# EAGLE design RasPi-24-Sensor-Breakout (EAGLE 7.5.0)
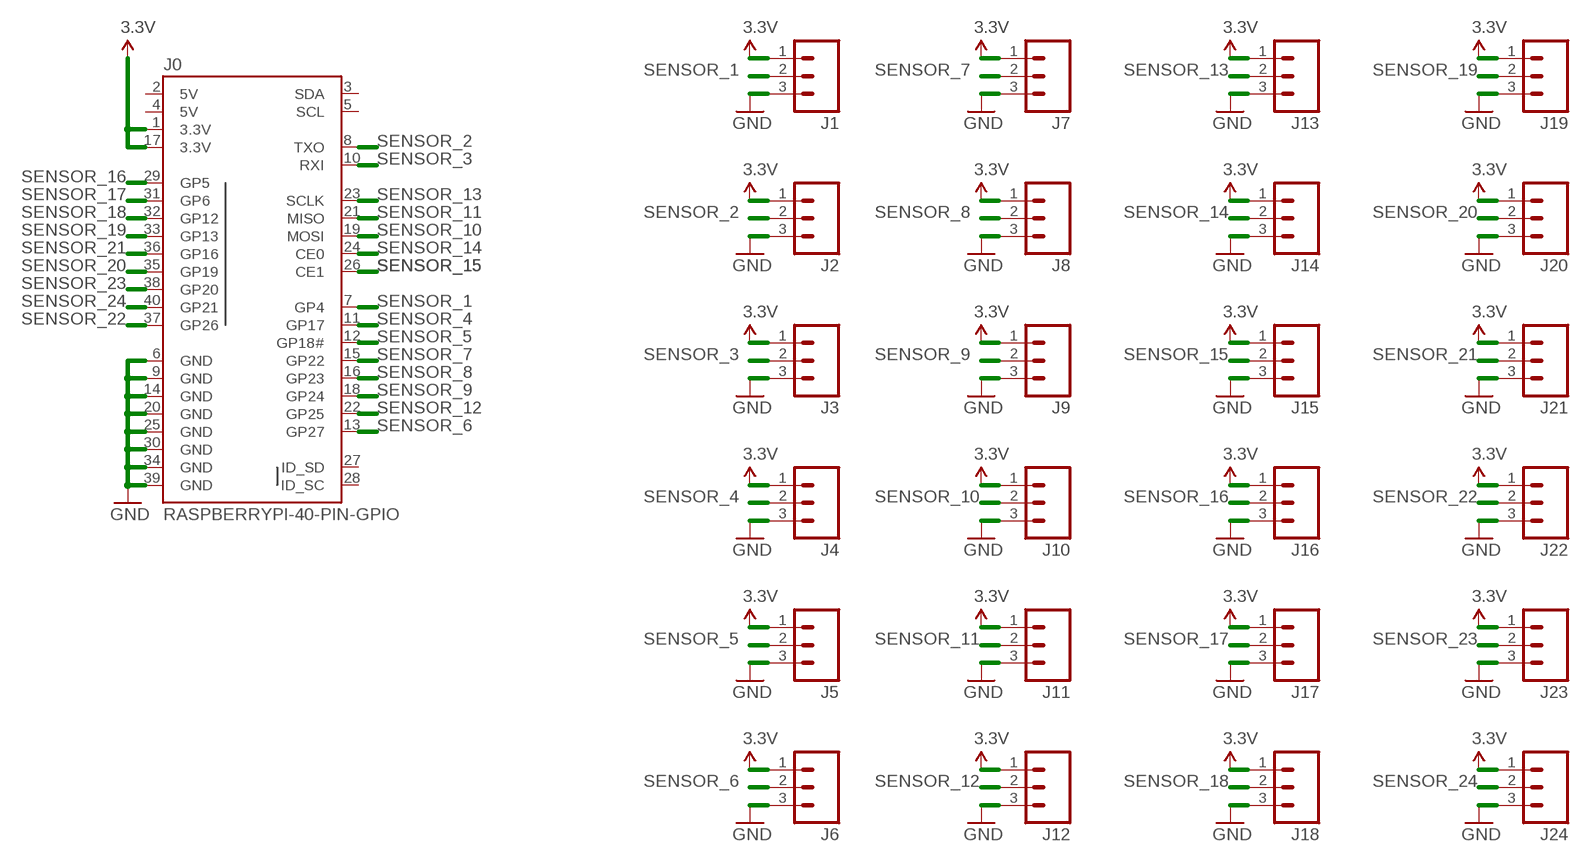
[diagram p0: schematic, sheet 1]

## Parts
J0  RASPBERRYPI-40-PIN-GPIO  [2X20-SHROUDED]
J1  M03POLAR  [MOLEX-1X3]
J2  M03POLAR  [MOLEX-1X3]
J3  M03POLAR  [MOLEX-1X3]
J4  M03POLAR  [MOLEX-1X3]
J5  M03POLAR  [MOLEX-1X3]
J6  M03POLAR  [MOLEX-1X3]
J7  M03POLAR  [MOLEX-1X3]
J8  M03POLAR  [MOLEX-1X3]
J9  M03POLAR  [MOLEX-1X3]
J10  M03POLAR  [MOLEX-1X3]
J11  M03POLAR  [MOLEX-1X3]
J12  M03POLAR  [MOLEX-1X3]
J13  M03POLAR  [MOLEX-1X3]
J14  M03POLAR  [MOLEX-1X3]
J15  M03POLAR  [MOLEX-1X3]
J16  M03POLAR  [MOLEX-1X3]
J17  M03POLAR  [MOLEX-1X3]
J18  M03POLAR  [MOLEX-1X3]
J19  M03POLAR  [MOLEX-1X3]
J20  M03POLAR  [MOLEX-1X3]
J21  M03POLAR  [MOLEX-1X3]
J22  M03POLAR  [MOLEX-1X3]
J23  M03POLAR  [MOLEX-1X3]
J24  M03POLAR  [MOLEX-1X3]

## Nets
3.3V: J0.1(3.3V) J0.17(3.3V) J1.1 J2.1 J3.1 J4.1 J5.1 J6.1 J7.1 J8.1 J9.1 J10.1 J11.1 J12.1 J13.1 J14.1 J15.1 J16.1 J17.1 J18.1 J19.1 J20.1 J21.1 J22.1 J23.1 J24.1
GND: J0.6(GND) J0.9(GND) J0.14(GND) J0.20(GND) J0.25(GND) J0.30(GND) J0.34(GND) J0.39(GND) J1.3 J2.3 J3.3 J4.3 J5.3 J6.3 J7.3 J8.3 J9.3 J10.3 J11.3 J12.3 J13.3 J14.3 J15.3 J16.3 J17.3 J18.3 J19.3 J20.3 J21.3 J22.3 J23.3 J24.3
SENSOR_1: J0.7(GP4) J1.2
SENSOR_2: J0.8(TXO) J2.2
SENSOR_3: J0.10(RXI) J3.2
SENSOR_4: J0.11(GP17) J4.2
SENSOR_5: J0.12(GP18#) J5.2
SENSOR_6: J0.13(GP27) J6.2
SENSOR_7: J0.15(GP22) J7.2
SENSOR_8: J0.16(GP23) J8.2
SENSOR_9: J0.18(GP24) J9.2
SENSOR_10: J0.19(MOSI) J10.2
SENSOR_11: J0.21(MISO) J11.2
SENSOR_12: J0.22(GP25) J12.2
SENSOR_13: J0.23(SCLK) J13.2
SENSOR_14: J0.24(CE0) J14.2
SENSOR_15: J0.26(CE1) J15.2
SENSOR_16: J0.29(GP5) J16.2
SENSOR_17: J0.31(GP6) J17.2
SENSOR_18: J0.32(GP12) J18.2
SENSOR_19: J0.33(GP13) J19.2
SENSOR_20: J0.35(GP19) J20.2
SENSOR_21: J0.36(GP16) J21.2
SENSOR_22: J0.37(GP26) J22.2
SENSOR_23: J0.38(GP20) J23.2
SENSOR_24: J0.40(GP21) J24.2
Unconnected: J0.3(SDA) J0.5(SCL) J0.27(ID_SD) J0.28(ID_SC)

## Power pins joined to a net without a drawn wire
5V: J0.2(5V) J0.4(5V)

## Library data of the parts
J0 = SparkFun-Boards:RASPBERRYPI-40-PIN-GPIO: Second Generation Raspberry Pi GPIO Header 2x20 pin connector, as found on B, B+, A+ models.
J1-J24 = SparkFun-Connectors:M03: Header 3 Standard 3-pin 0.1" header. Use with straight break away headers (SKU : PRT-00116), right angle break away headers (PRT-00553), swiss pins (PRT-00743), machine pins (PRT-00117), and female headers (PRT-00115). Molex polarized connector foot print use with SKU : PRT-08232 with associated crimp pins and housings.

## Board
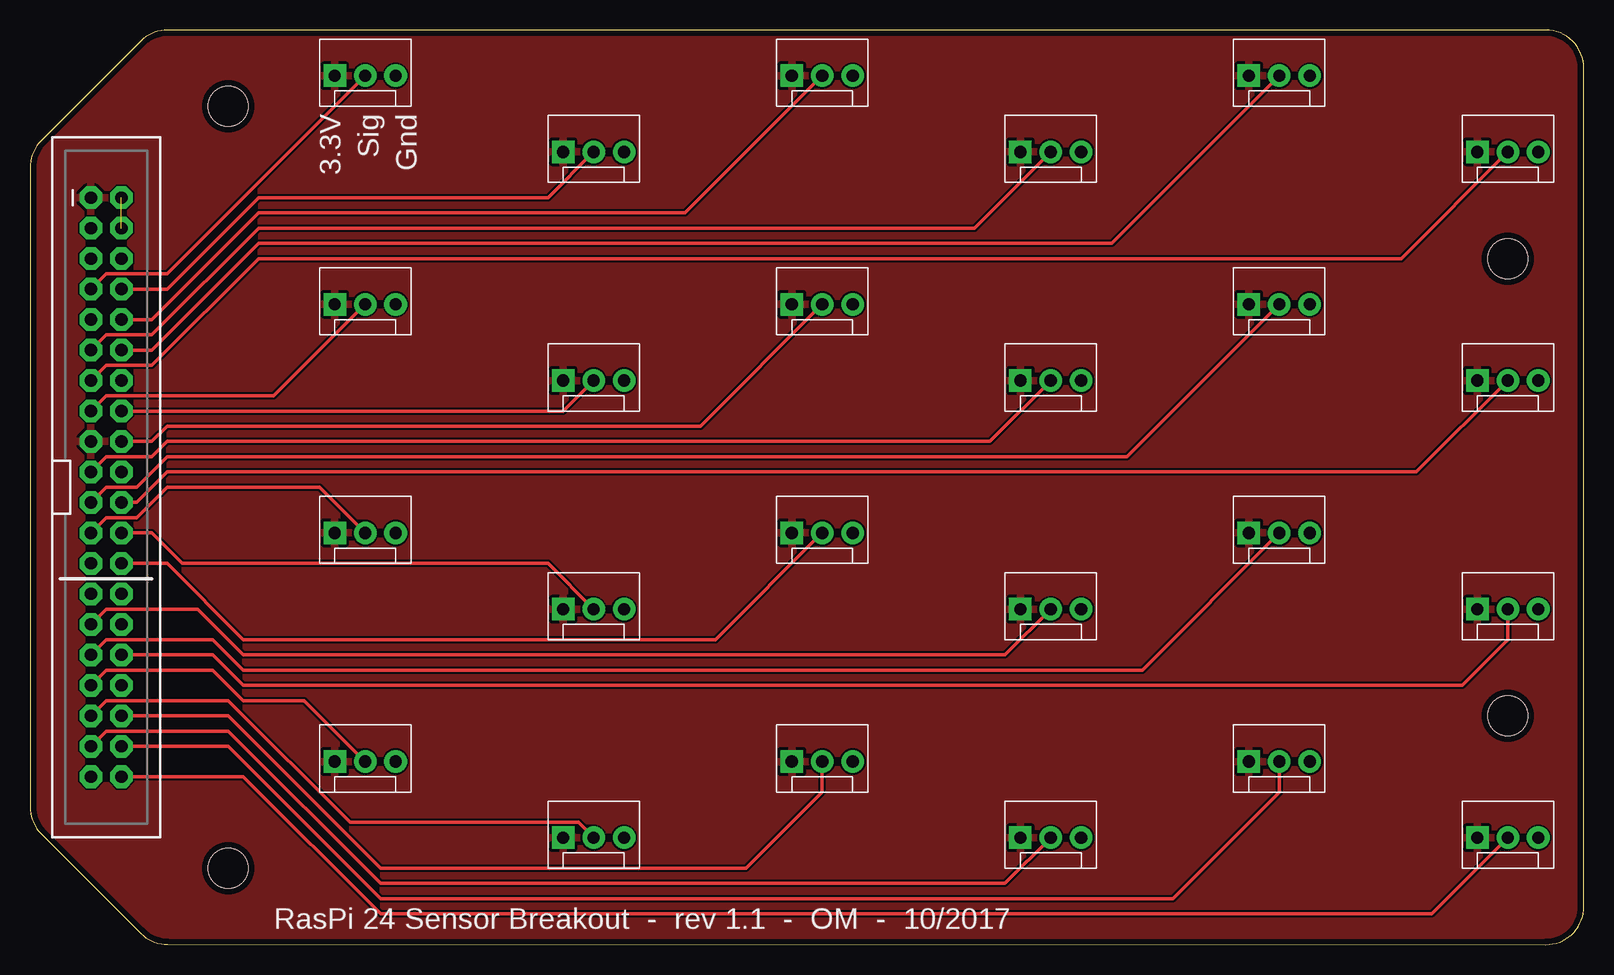
[diagram p1: board, top side]
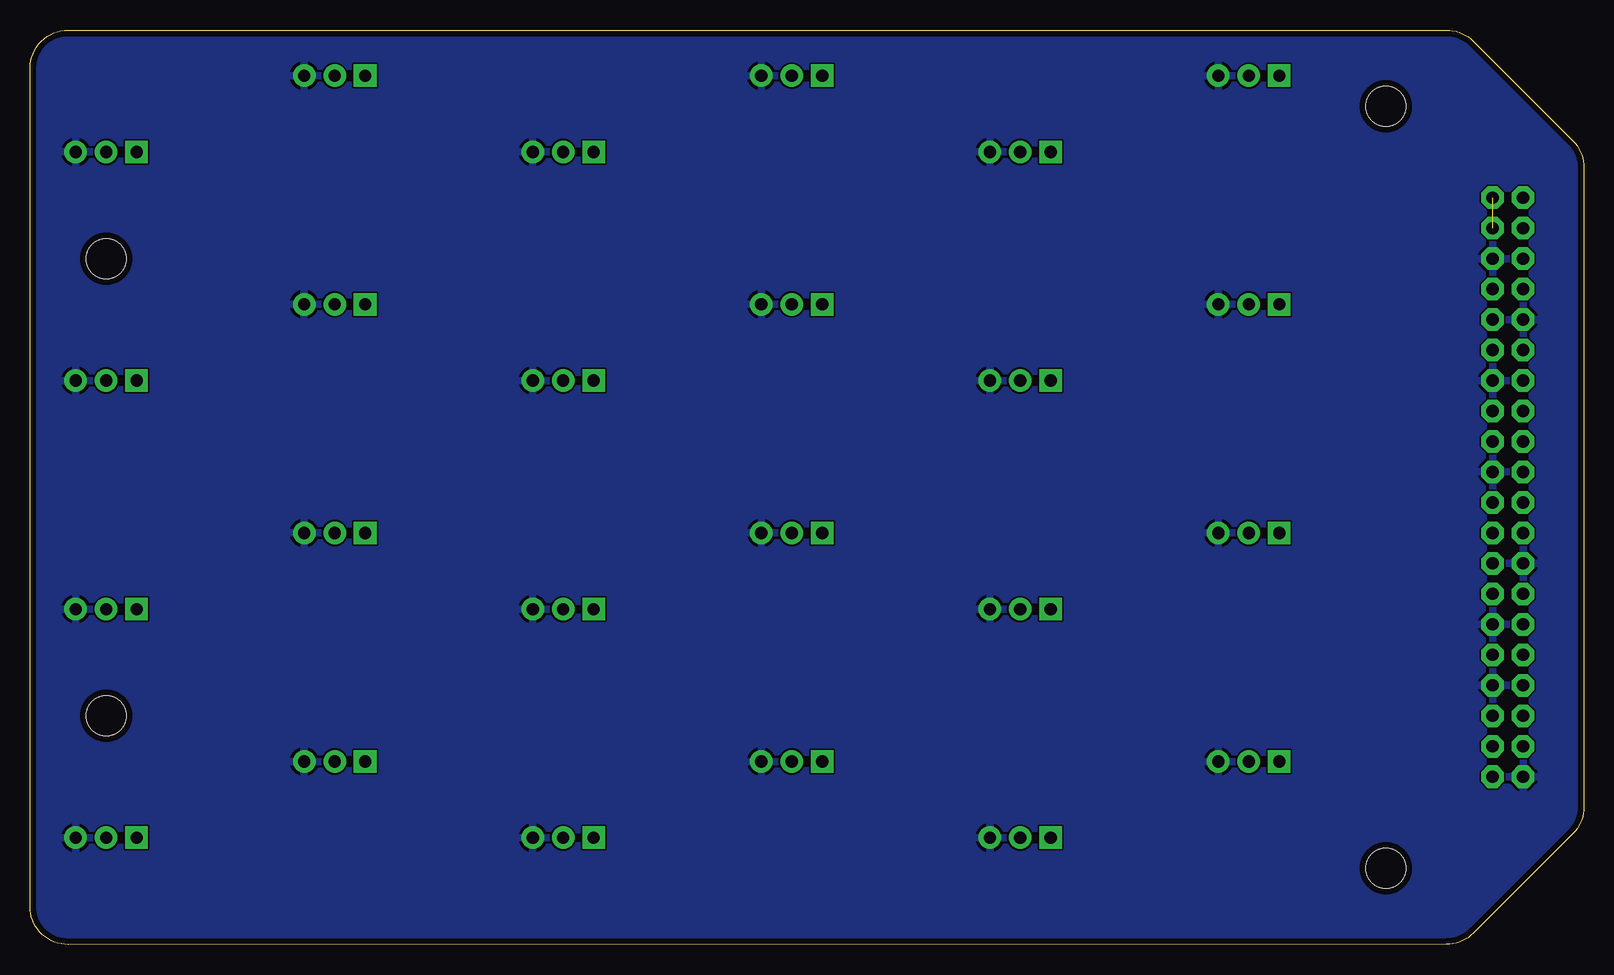
[diagram p2: board, bottom side, seen from below]

Size 129.54 x 76.22 mm. Coordinates in mm from the lower left corner, seen from the top.
Outline: 0,64.74 0,11.49 arc45 0.93,9.25 9.23,0.95 arc45 11.47,0.02 126.36,0 arc90 129.54,3.18 129.52,73.04 arc90 126.35,76.22 11.47,76.22 arc45 9.23,75.29 0.93,66.99 arc45 0,64.74
Copper layers (1*16): Top 0.0178mm / dielectric 59mil / Bottom 0.0178mm
Design rules "SSC-EAGLE-2Lyr_v1.0.0.3": minimum track width 6mil, minimum drill 14mil, track to track 6mil, track to pad 6mil, pad to pad 6mil, via to via 6mil, smd to smd 6mil, copper to edge 20mil, drill to drill 16mil, minimum pad ring 8mil, minimum via ring 8mil, stop-mask expansion 3mil, vias tented up to drill 0mil, thermal gap 10mil

### Footprints (pad centres in the part's own frame; a part is rotated, then mirrored left to right if it is on the bottom)
2X20-SHROUDED = drill 1.016 pad 1.88 octagon: 1 -1.27,24.13; 2 1.27,24.13; 3 -1.27,21.59; 4 1.27,21.59; 5 -1.27,19.05; 6 1.27,19.05; 7 -1.27,16.51; 8 1.27,16.51; 9 -1.27,13.97; 10 1.27,13.97; 11 -1.27,11.43; 12 1.27,11.43; 13 -1.27,8.89; 14 1.27,8.89; 15 -1.27,6.35; 16 1.27,6.35; 17 -1.27,3.81; 18 1.27,3.81; 19 -1.27,1.27; 20 1.27,1.27; 21 -1.27,-1.27; 22 1.27,-1.27; 23 -1.27,-3.81; 24 1.27,-3.81; 25 -1.27,-6.35; 26 1.27,-6.35; 27 -1.27,-8.89; 28 1.27,-8.89; 29 -1.27,-11.43; 30 1.27,-11.43; 31 -1.27,-13.97; 32 1.27,-13.97; 33 -1.27,-16.51; 34 1.27,-16.51; 35 -1.27,-19.05; 36 1.27,-19.05; 37 -1.27,-21.59; 38 1.27,-21.59; 39 -1.27,-24.13; 40 1.27,-24.13
MOLEX-1X3 = drill 1.016 pad 1.88 square: 1 0,0 | drill 1.016 pad 1.88: 2 2.54,0; 3 5.08,0
STAND-OFF = hole 3.302: 0,0

### Placement (x,y rotation side)
J0  6.35,38.12 0 top
J1  25.4,72.41 0 top
J2  44.45,66.06 0 top
J3  63.5,72.41 0 top
J4  82.55,66.06 0 top
J5  101.6,72.41 0 top
J6  120.65,66.06 0 top
J7  25.4,53.36 0 top
J8  44.45,47.01 0 top
J9  63.5,53.36 0 top
J10  82.55,47.01 0 top
J11  101.6,53.36 0 top
J12  120.65,47.01 0 top
J13  25.4,34.31 0 top
J14  44.45,27.96 0 top
J15  63.5,34.31 0 top
J16  82.55,27.96 0 top
J17  101.6,34.31 0 top
J18  120.65,27.96 0 top
J19  25.4,15.26 0 top
J20  44.45,8.91 0 top
J21  63.5,15.26 0 top
J22  82.55,8.91 0 top
J23  101.6,15.26 0 top
J24  120.65,8.91 0 top
U$1  [STAND-OFF]  123.19,57.17 0 top
U$2  [STAND-OFF]  123.19,19.07 0 top
U$3  [STAND-OFF]  16.51,6.37 0 top
U$4  [STAND-OFF]  16.51,69.87 0 top

### Tracks (layer width: path | path; a pad name or v marks a point on that pad's centre or on a via)
3.3V
  pour Top: 0,76.22 129.54,76.22 129.54,0.02 0,0.02
5V  (1 unrouted)
GND
  pour Bottom: 0,76.22 129.54,76.22 129.54,0.02 0,0.02
SENSOR_1
  Top 0.305: J0.7 6.35,55.9 11.43,55.9 J1.2
SENSOR_2
  Top 0.305: J0.8 11.43,54.63 19.05,62.25 43.18,62.25 J2.2
SENSOR_3
  Top 0.305: J0.10 10.16,52.09 19.05,60.98 54.61,60.98 J3.2
SENSOR_4
  Top 0.305: J0.11 6.35,50.82 10.16,50.82 19.05,59.71 78.74,59.71 J4.2
SENSOR_5
  Top 0.305: J0.12 10.16,49.55 19.05,58.44 90.17,58.44 J5.2
SENSOR_6
  Top 0.305: J0.13 6.35,48.28 10.16,48.28 19.05,57.17 114.3,57.17 J6.2
SENSOR_7
  Top 0.305: J0.15 6.35,45.74 20.32,45.74 J7.2
SENSOR_8
  Top 0.305: J0.16 44.45,44.47 J8.2
SENSOR_9
  Top 0.305: J0.18 10.16,41.93 11.43,43.2 55.88,43.2 J9.2
SENSOR_10
  Top 0.305: J0.19 6.35,40.66 10.16,40.66 11.43,41.93 80.01,41.93 J10.2
SENSOR_11
  Top 0.305: J0.21 6.35,38.12 8.89,38.12 11.43,40.66 91.44,40.66 J11.2
SENSOR_12
  Top 0.305: J0.22 8.89,36.85 11.43,39.39 115.57,39.39 J12.2
SENSOR_13
  Top 0.305: J0.23 6.35,35.58 8.89,35.58 11.43,38.12 24.13,38.12 J13.2
SENSOR_14
  Top 0.305: J0.24 10.16,34.31 12.7,31.77 43.18,31.77 J14.2
SENSOR_15
  Top 0.305: J0.26 11.43,31.77 17.78,25.42 57.15,25.42 J15.2
SENSOR_16
  Top 0.305: J0.29 6.35,27.96 13.97,27.96 17.78,24.15 81.28,24.15 J16.2
SENSOR_17
  Top 0.305: J0.31 6.35,25.42 15.24,25.42 17.78,22.88 92.71,22.88 J17.2
SENSOR_18
  Top 0.305: J0.32 15.24,24.15 17.78,21.61 119.38,21.61 123.19,25.42 J18.2
SENSOR_19
  Top 0.305: J0.33 6.35,22.88 15.24,22.88 17.78,20.34 22.86,20.34 J19.2
SENSOR_20
  Top 0.305: J0.35 6.35,20.34 16.51,20.34 26.67,10.18 45.72,10.18 J20.2
SENSOR_21
  Top 0.305: J0.36 16.51,19.07 29.21,6.37 59.69,6.37 66.04,12.72 J21.2
SENSOR_22
  Top 0.305: J0.37 6.35,17.8 16.51,17.8 29.21,5.1 81.28,5.1 J22.2
SENSOR_23
  Top 0.305: J23.2 104.14,12.72 95.25,3.83 29.21,3.83 16.51,16.53 J0.38
SENSOR_24
  Top 0.305: J0.40 17.78,13.99 29.21,2.56 116.84,2.56 J24.2

### Text on the board
tPlace: 3.3V | Sig | Gnd | RasPi 24 Sensor Breakout - rev 1.1 - OM - 10/2017
tValues: 1 | 3 | 5 | 2 | 4 | 6 | 7 | 9 | 11 | 8 | 10 | 12 | 13 | 15 | 17 | 14 | 16 | 18 | 19 | 21 | 23 | 20 | 22 | 24